# Altium project Rückleuchte.PrjPcb
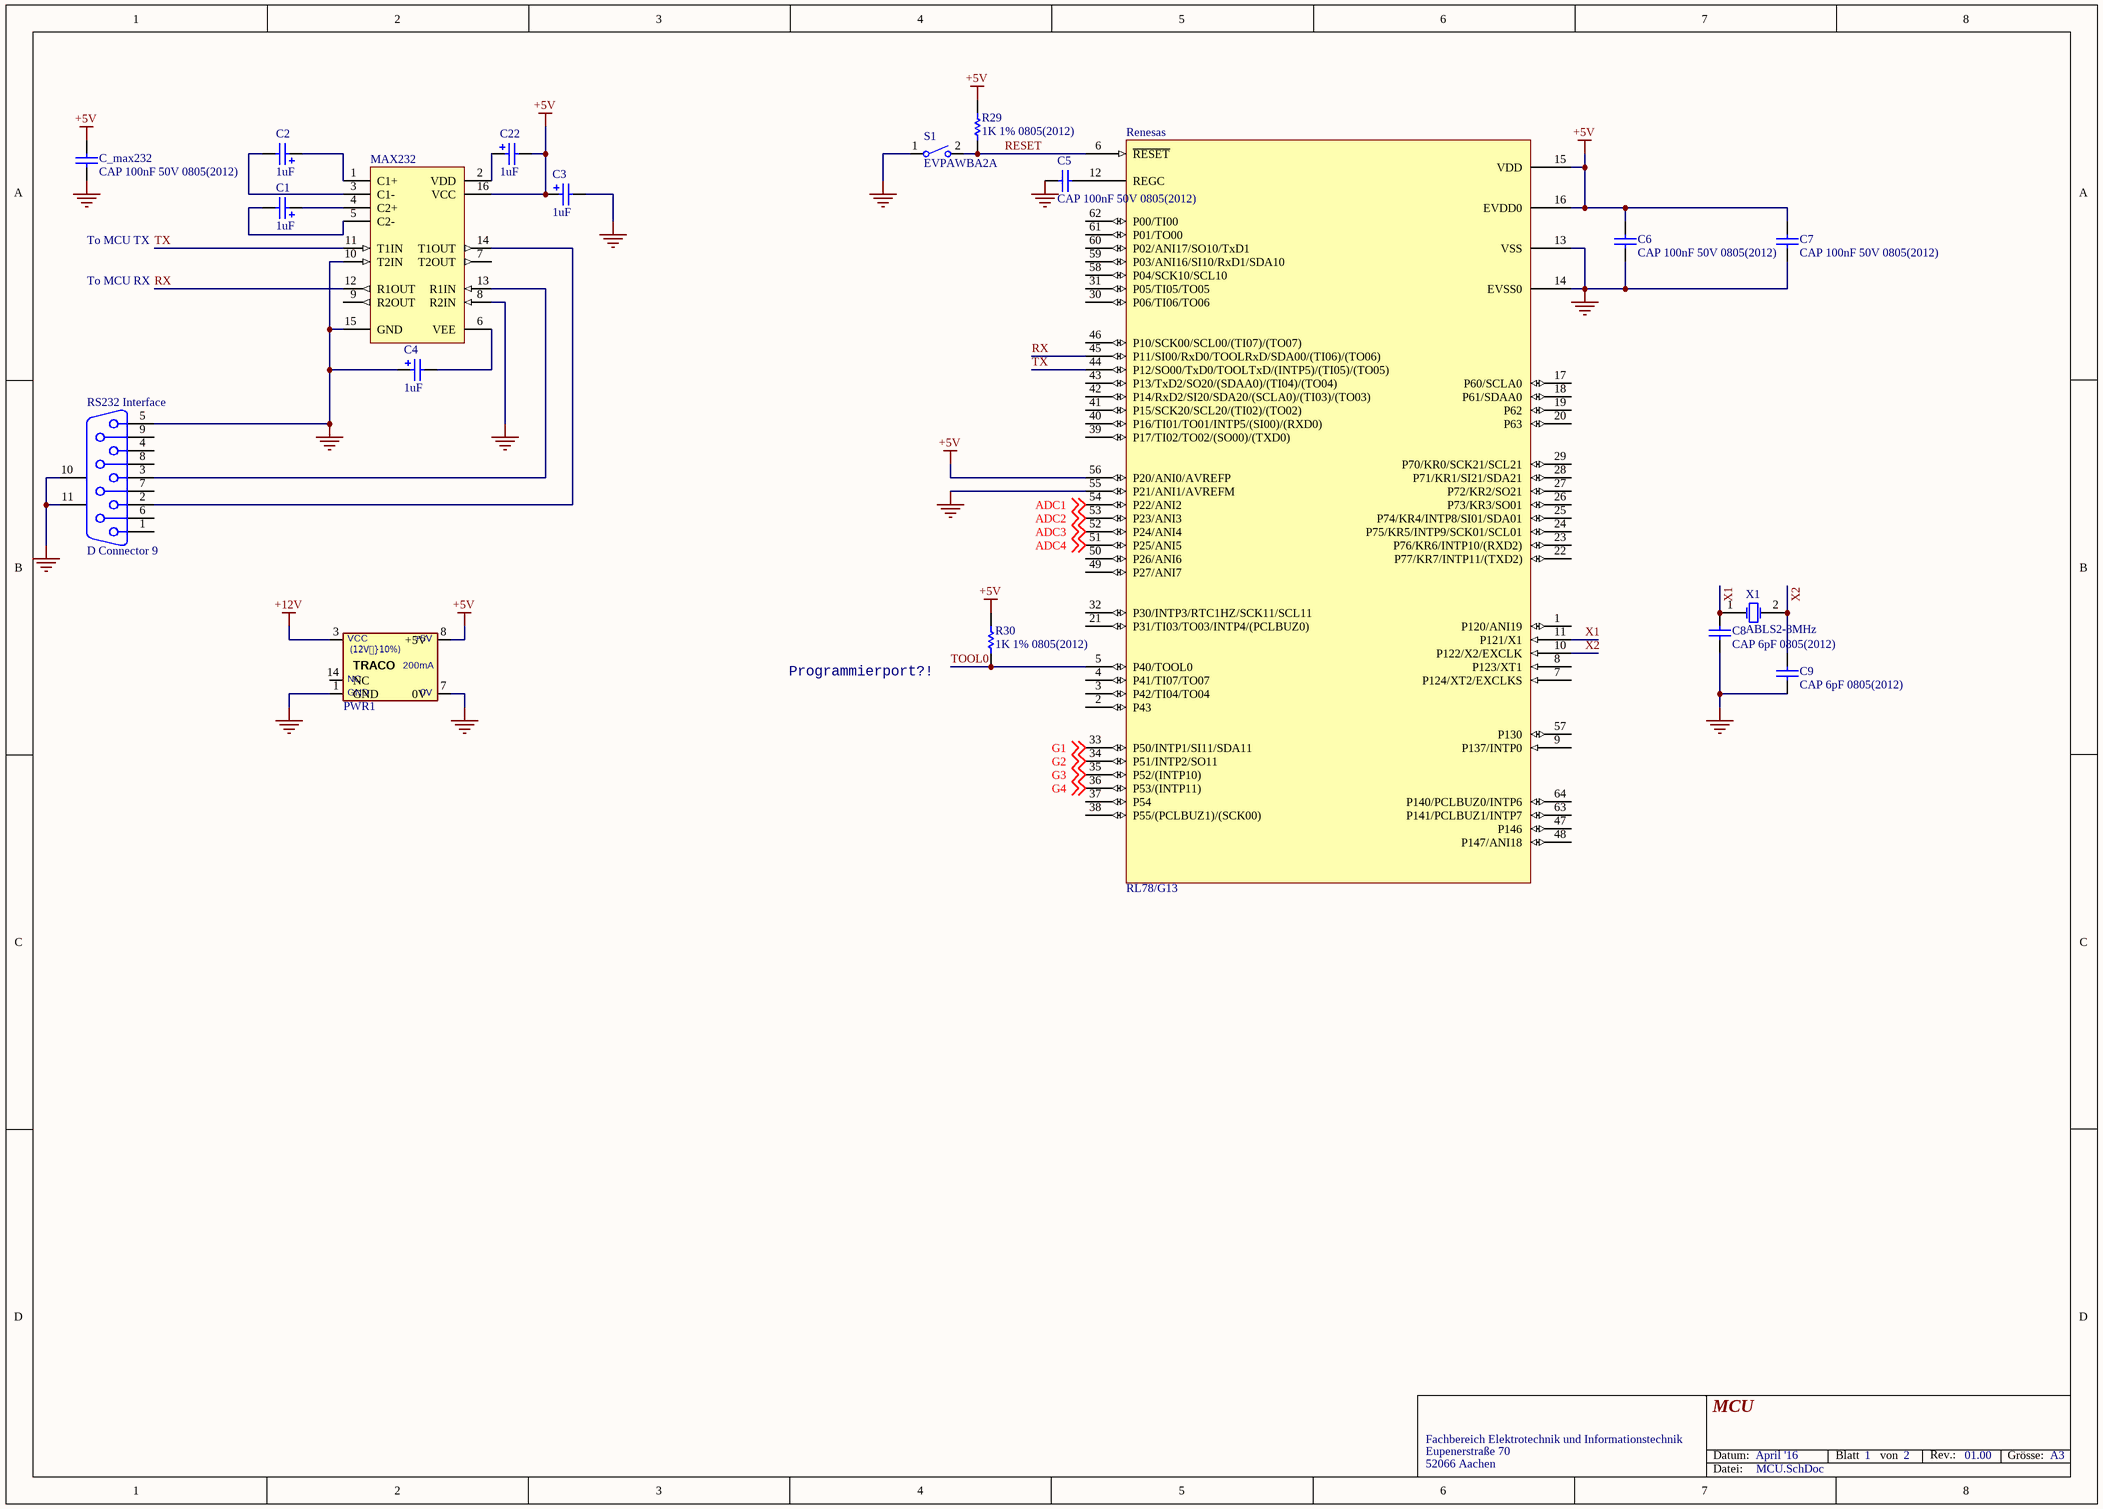
[diagram p0: MCU.SchDoc]
2 sheets, 59 parts. Net scope: global (net labels, ports and power ports of the same name join across sheets).
Sheets:
  MCU.SchDoc
  HS-Treiber.SchDoc

## Sheet MCU.SchDoc: MCU
size A3; Date: April '16; Organization: Fachhochschule Aachen; Address1: Fachbereich Elektrotechnik und Informationstechnik; Address2: Eupenerstraße 70; Address3: 52066 Aachen; DocumentNumber: 1; Revision: 01.00; SheetNumber: 1; SheetTotal: 2; ModifiedDate: -> Datum

### Parts
C1  value 1uF  [CC2012-0805]  (hidden comment: Cap Pol3)
C2  value 1uF  [CC2012-0805]  (hidden comment: Cap Pol3)
C3  value 1uF  [CC2012-0805]  (hidden comment: Cap Pol3)
C4  value 1uF  [CC2012-0805]  (hidden comment: Cap Pol3)
C5  CAP 100nF 50V 0805(2012)  [CAPC0805(2012)145_M]
C6  CAP 100nF 50V 0805(2012)  [CAPC0805(2012)145_M]
C7  CAP 100nF 50V 0805(2012)  [CAPC0805(2012)145_M]
C8  CAP 6pF 0805(2012)  [CAPC0805(2012)145_M]
C9  CAP 6pF 0805(2012)  [CAPC0805(2012)145_M]
C22  value 1uF  [CC2012-0805]  (hidden comment: Cap Pol3)
C_max232  CAP 100nF 50V 0805(2012)  [CAPC0805(2012)145_M]
MAX232  MAX232CSE  [NSO16]  (value not drawn)
PWR1  TES1-1211  [TES14]  (value not drawn)
R29  1K 1% 0805(2012)  [RESC0805(2012)_M]
R30  1K 1% 0805(2012)  [RESC0805(2012)_M]
Renesas  RL78/G13  [R5F100LEAFA - duplicate]
RS232_Interface  D Connector 9  [DSUB1.385-2H9]
S1  EVPAWBA2A  [PNSC-EVPAW_V]
X1  ABLS2-8MHz  [ABRA-ABLS2-2_V]

### Nets
+5V: C3.1 C6.2 C7.2 C22.2 C_max232.2 MAX232.16(VCC) PWR1.8(+5V) R29.1 R30.1 Renesas.15(VDD) Renesas.16(EVDD0) Renesas.56(P20/ANI0/AVREFP)
+12V: PWR1.3(VCC)
GND: C3.2 C4.1 C5.2 C6.1 C7.1 C8.1 C9.1 C_max232.1 MAX232.8(R2IN) MAX232.10(T2IN) MAX232.15(GND) PWR1.1(GND) PWR1.7(0V) Renesas.13(VSS) Renesas.14(EVSS0) Renesas.55(P21/ANI1/AVREFM) RS232_Interface.5 RS232_Interface.10(MH1) RS232_Interface.11(MH2) S1.1(A1)
ADC1: Renesas.54(P22/ANI2) ; off-sheet ADC1
ADC2: Renesas.53(P23/ANI3) ; off-sheet ADC2
ADC3: Renesas.52(P24/ANI4) ; off-sheet ADC3
ADC4: Renesas.51(P25/ANI5) ; off-sheet ADC4
G1: Renesas.33(P50/INTP1/SI11/SDA11) ; off-sheet G1
G2: Renesas.34(P51/INTP2/SO11) ; off-sheet G2
G3: Renesas.35(P52/(INTP10)) ; off-sheet G3
G4: Renesas.36(P53/(INTP11)) ; off-sheet G4
RESET: R29.2 Renesas.6(~{RESET}) S1.2(B1)
RX: MAX232.12(R1OUT) Renesas.45(P11/SI00/RxD0/TOOLRxD/SDA00/(TI06)/(TO06))
TOOL0: R30.2 Renesas.5(P40/TOOL0)
TX: MAX232.11(T1IN) Renesas.44(P12/SO00/TxD0/TOOLTxD/(INTP5)/(TI05)/(TO05))
X1: C8.2 Renesas.11(P121/X1) X1.1(X1)
X2: C9.2 Renesas.10(P122/X2/EXCLK) X1.2(X2)
NetC1_1: C1.1 MAX232.4(C2+)
NetC1_2: C1.2 MAX232.5(C2-)
NetC2_1: C2.1 MAX232.1(C1+)
NetC2_2: C2.2 MAX232.3(C1-)
NetC4_2: C4.2 MAX232.6(VEE)
NetC5_1: C5.1 Renesas.12(REGC)
NetC22_1: C22.1 MAX232.2(VDD)
NetMAX232_13: MAX232.13(R1IN) RS232_Interface.3
NetMAX232_14: MAX232.14(T1OUT) RS232_Interface.2

Not connected (* = marked no-connect by the designer): MAX232 7(T2OUT) 9(R2OUT); PWR1 14(NC); Renesas 1(P120/ANI19) 2(P43) 3(P42/TI04/TO04) 4(P41/TI07/TO07) 7(P124/XT2/EXCLKS) 8(P123/XT1) 9(P137/INTP0) 17(P60/SCLA0) 18(P61/SDAA0) 19(P62) 20(P63) 21(P31/TI03/TO03/INTP4/(PCLBUZ0)) 22(P77/KR7/INTP11/(TXD2)) 23(P76/KR6/INTP10/(RXD2)) 24(P75/KR5/INTP9/SCK01/SCL01) 25(P74/KR4/INTP8/SI01/SDA01) 26(P73/KR3/SO01) 27(P72/KR2/SO21) 28(P71/KR1/SI21/SDA21) 29(P70/KR0/SCK21/SCL21) 30(P06/TI06/TO06) 31(P05/TI05/TO05) 32(P30/INTP3/RTC1HZ/SCK11/SCL11) 37(P54) 38(P55/(PCLBUZ1)/(SCK00)) 39(P17/TI02/TO02/(SO00)/(TXD0)) 40(P16/TI01/TO01/INTP5/(SI00)/(RXD0)) 41(P15/SCK20/SCL20/(TI02)/(TO02)) 42(P14/RxD2/SI20/SDA20/(SCLA0)/(TI03)/(TO03)) 43(P13/TxD2/SO20/(SDAA0)/(TI04)/(TO04)) 46(P10/SCK00/SCL00/(TI07)/(TO07)) 47(P146) 48(P147/ANI18) 49(P27/ANI7) 50(P26/ANI6) 57(P130) 58(P04/SCK10/SCL10) 59(P03/ANI16/SI10/RxD1/SDA10) 60(P02/ANI17/SO10/TxD1) 61(P01/TO00) 62(P00/TI00) 63(P141/PCLBUZ1/INTP7) 64(P140/PCLBUZ0/INTP6); RS232_Interface 1 4 6 7 8 9

### Notes on the sheet
- To MCU TX
- To MCU RX
- Programmierport?!
- Datum:
- Blatt
- von
- Rev.:
- Grösse:
- A3
- Datei:
- (in symbol TES1-1211) (12V}10%); 200mA

### Library data of the parts
C1-C4 C22 = Cap Pol3: Polarized Capacitor (Surface Mount); Published: 8-Jun-2000; Revision: July-2002: Re-released for DXP Platform.; Publisher: Altium Limited
C5-C9 C_max232 = CMP-1036-04419-1: CAP 100nF 50V ±10% 0805 (2012 Metric) Thickness 1.45mm SMD; Tolerance: Â±10%; Case-EIA: 0805; Case-Metric: 2012; Rated Voltage: 50 V; Technology: SMT; Max Thickness: 1.45 mm; Value: 100nF
MAX232 = MAX232CSE: +5V Powered, Multi-Channel RS-232 Driver/Receiver; Code - JEDEC: MS-012-AC; Code - IPC: SO16; Published: 16-Jan-2001; Revision: 17-Jul-2002: Re-released for DXP Platform.; Package Reference: NSO16; Publisher: Altium Limited
PWR1 = TES1-1211: Input=12V}10% Output=5V 200mA 1W 1500VDC Isolation SMD14 RoHS; Manufactuer: TRACO; Manufactuer P/N: TES1-1211; HelpURL: http://www.tracopower.com/
R29 R30 = CMP-1013-00623-1: 10K 0.125W 1% 0805 (2012 Metric)  SMD; Value: 10000.00 Ohm; Case-Metric: 2012; Case-EIA: 0805; Tolerance: 1 %; Power: 0.125 W; Technology: SMT
RS232_Interface = D Connector 9: Receptacle Assembly, 9 Position, Right Angle; Package Information: Latest Revision: O; Positions: 9; Published: 15-Jun-2001; Revision: 17-Jul-2002: Re-released for DXP Platform.; Datasheet: (1-Sep-1999); Package Reference: 788750; Publisher: Altium Limited; Orientation: Right Angle; Gender: Receptacle
S1 = CMP-1339-00001-1: Light Touch Switch, 0.02 A at 15 VDC, 500 mOhm, -40 to 85 degC, 2-Pin 3 x 2 x 0.6 mm SMD, RoHS, Tape and Reel; Manufacturer: Panasonic; Contact Rating@2 VDC: 10 uA; Contact Resistance: 500 mOhm Max.; Contact Rating@15 VDC: 0.02 A; Insulation Resistance@100 VDC: 50 MOhm Min.; Bouncing: 10 ms Max.; RoHS: TRUE; Temperature Range: -40 to 85 degC; ComponentLink1URL: http://na.industrial.panasonic.com/; ComponentLink2URL: http://industrial.panasonic.com/www-data/pdf/ATK0000/ATK0000CE40.pdf; ComponentLink2Description: Datasheet; ComponentLink1Description: Manufacturer URL; ComponentLink3URL: http://industrial.panasonic.com/www-data/pdf/ATK0000/ATK0000CE40.pdf; PackageDescription: 2-Pin Surface Mount Device, Body 3 x 2 mm, Pitch 3.25 mm; DatasheetVersion: May-14; Mounting Technology: Surface Mount; Packing: Tape and Reel; PartNumber: EVPAWBA2A; ComponentLink3Description: Package Specification
X1 = CMP-0277-00002-1: Low Profile Surface Mount Microprocessor Crystal, 4.096 MHz +/-30 ppm, 180 Ohm, -40 to 85 degC, 2-Pin 11.4 x 4.7 x 3.3 mm SMD, RoHS, Tape and Reel; Manufacturer: Abracon; PartNumber: ABLS2-4.096MHZ-D4Y-T; Operation Mode: Fundamental or 3rd Overtone; Shunt Capacitance: 7 pF Max.; ESR: 180 Ohm; Load Capacitance: 18 pF; Mounting Technology: Surface Mount; PackageDescription: 2-Pin SMD, Body 11.4 x 4.7 mm, Height 3.3 mm; ComponentLink1URL: http://www.abracon.com/; Freq. Stability: +/- 30 ppm; ComponentLink2Description: Datasheet; Operating Temp. Range: -40 to 85 degC; Packing: Tape and Reel; RoHS: TRUE; PackageReference: ABLS2-2; DatasheetVersion: Rev. 03.31.11; Freq. Tolerance: +/- 30 ppm; Frequency: 4.096 MHz; ComponentLink2URL: http://www.abracon.com/Resonators/ABLS2.pdf; ComponentLink1Description: Manufacturer URL

## Sheet HS-Treiber.SchDoc: HS-Treiber/Messung
size A4; Date: April '16; DrawnBy: Student; DocumentNumber: 2; SheetNumber: 2; SheetTotal: 2
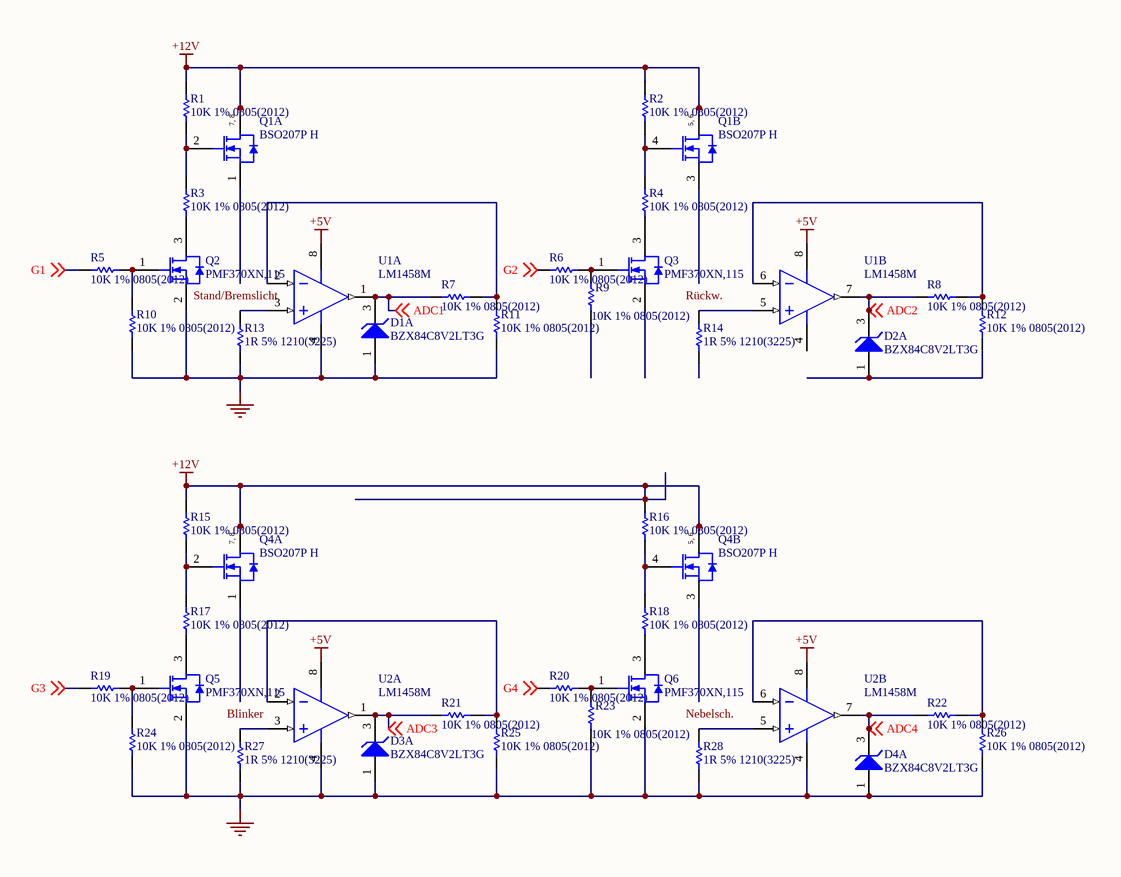
[diagram p1: HS-Treiber.SchDoc]

### Parts
D1  BZX84C8V2LT3G  [ONSC-SOT-23-3-318-08_V]  (part A of 2)
D2  BZX84C8V2LT3G  [ONSC-SOT-23-3-318-08_V]  (part A of 2)
D3  BZX84C8V2LT3G  [ONSC-SOT-23-3-318-08_V]  (part A of 2)
D4  BZX84C8V2LT3G  [ONSC-SOT-23-3-318-08_V]  (part A of 2)
Q1  BSO207P H  [INF-PG-DSO-8-3_L]  (parts A,B of 2)
Q2  PMF370XN,115  [NXP-SOT323_M]
Q3  PMF370XN,115  [NXP-SOT323_M]
Q4  BSO207P H  [INF-PG-DSO-8-3_L]  (parts A,B of 2)
Q5  PMF370XN,115  [NXP-SOT323_M]
Q6  PMF370XN,115  [NXP-SOT323_M]
R1  10K 1% 0805(2012)  [RESC0805(2012)_M]
R2  10K 1% 0805(2012)  [RESC0805(2012)_M]
R3  10K 1% 0805(2012)  [RESC0805(2012)_M]
R4  10K 1% 0805(2012)  [RESC0805(2012)_M]
R5  10K 1% 0805(2012)  [RESC0805(2012)_M]
R6  10K 1% 0805(2012)  [RESC0805(2012)_M]
R7  10K 1% 0805(2012)  [RESC0805(2012)_M]
R8  10K 1% 0805(2012)  [RESC0805(2012)_M]
R9  10K 1% 0805(2012)  [RESC0805(2012)_M]
R10  10K 1% 0805(2012)  [RESC0805(2012)_M]
R11  10K 1% 0805(2012)  [RESC0805(2012)_M]
R12  10K 1% 0805(2012)  [RESC0805(2012)_M]
R13  1R 5% 1210(3225)  [RESC1210(3225)_N]
R14  1R 5% 1210(3225)  [RESC1210(3225)_N]
R15  10K 1% 0805(2012)  [RESC0805(2012)_M]
R16  10K 1% 0805(2012)  [RESC0805(2012)_M]
R17  10K 1% 0805(2012)  [RESC0805(2012)_M]
R18  10K 1% 0805(2012)  [RESC0805(2012)_M]
R19  10K 1% 0805(2012)  [RESC0805(2012)_M]
R20  10K 1% 0805(2012)  [RESC0805(2012)_M]
R21  10K 1% 0805(2012)  [RESC0805(2012)_M]
R22  10K 1% 0805(2012)  [RESC0805(2012)_M]
R23  10K 1% 0805(2012)  [RESC0805(2012)_M]
R24  10K 1% 0805(2012)  [RESC0805(2012)_M]
R25  10K 1% 0805(2012)  [RESC0805(2012)_M]
R26  10K 1% 0805(2012)  [RESC0805(2012)_M]
R27  1R 5% 1210(3225)  [RESC1210(3225)_N]
R28  1R 5% 1210(3225)  [RESC1210(3225)_N]
U1  LM1458M  [M08A_L]  (parts A,B of 2)
U2  LM1458M  [M08A_L]  (parts A,B of 2)

### Nets
+5V: U1.8(V+) U2.8(V+)
+12V: Q1.5(D2) Q1.6(D2) Q1.7(D1) Q1.8(D1) Q4.5(D2) Q4.6(D2) Q4.7(D1) Q4.8(D1) R1.1 R2.1 R15.1 R16.1
GND: D1.1(A) D3.1(A) D4.1(A) Q2.2(S) Q5.2(S) Q6.2(S) R10.2 R11.2 R13.2 R23.2 R24.2 R25.2 R26.2 R27.2 R28.2 U1.4(V-) U2.4(V-)
ADC1: D1.3(K) R7.1 U1.1(OUTA) ; off-sheet ADC1
ADC2: D2.3(K) R8.2 U1.7(OUTB) ; off-sheet ADC2
ADC3: D3.3(K) R21.1 U2.1(OUTA) ; off-sheet ADC3
ADC4: D4.3(K) R22.2 U2.7(OUTB) ; off-sheet ADC4
G1: R5.2 ; off-sheet G1
G2: R6.2 ; off-sheet G2
G3: R19.2 ; off-sheet G3
G4: R20.2 ; off-sheet G4
NetD2_1: D2.1(A) R12.2
NetQ1_2: Q1.2(G1) R1.2 R3.1
NetQ1_4: Q1.4(G2) R2.2 R4.1
NetQ2_1: Q2.1(G) R5.1 R10.1
NetQ2_3: Q2.3(D) R3.2
NetQ3_1: Q3.1(G) R6.1 R9.1
NetQ3_3: Q3.3(D) R4.2
NetQ4_2: Q4.2(G1) R15.2 R17.1
NetQ4_4: Q4.4(G2) R16.2 R18.1
NetQ5_1: Q5.1(G) R19.1 R24.1
NetQ5_3: Q5.3(D) R17.2
NetQ6_1: Q6.1(G) R20.1 R23.1
NetQ6_3: Q6.3(D) R18.2
NetR7_2: R7.2 R11.1 U1.2(INA-)
NetR8_1: R8.1 R12.1 U1.6(INB-)
NetR13_1: R13.1 U1.3(INA+)
NetR14_1: R14.1 U1.5(INB+)
NetR21_2: R21.2 R25.1 U2.2(INA-)
NetR22_1: R22.1 R26.1 U2.6(INB-)
NetR27_1: R27.1 U2.3(INA+)
NetR28_1: R28.1 U2.5(INB+)

Not connected (* = marked no-connect by the designer): Q1 1(S1) 3(S2); Q3 2(S); Q4 1(S1) 3(S2); R9 2; R14 2

### Notes on the sheet
- Stand/Bremslicht
- (near R14) Rückw.
- Blinker
- (near R28) Nebelsch.
- Datum:
- Blatt
- von
- Rev.:
- Grösse:
- A4
- Datei:
- (in symbol CMP-1099-00011-1, part A) 7, 8
- (in symbol CMP-1099-00011-1, part B) 5, 6

### Library data of the parts
D1-D4 = CMP-1060-01015-1: Zener Voltage Regulator, 225 mW, 3-Pin SOT-23, Pb-Free, Tape and Reel; Manufacturer: On Semiconductor; ComponentLink1Description: Manufacturer URL; PackageReference: SOT-23-3-318-08; ComponentLink3URL: http://www.onsemi.cn/pub_link/Collateral/318-08.PDF; Mounting Technology: Surface Mount; PackageDescription: 3-Pin Small Outline Transistor, Body 2.92 x 1.3 mm, Pitch 0.95 mm; PartNumber: BZX84C8V2LT3G; DatasheetVersion: Rev. 17; RoHS: Pb-Free; ComponentLink3Description: Package Specification; ComponentLink2Description: Datasheet; ComponentLink1URL: http://www.onsemi.com/; Packing: Tape and Reel; ComponentLink2URL: http://www.onsemi.com/pub_link/Collateral/BZX84C2V4LT1-D.PDF; PackageVersion: Rev. AP, 11/2009; PartId: 1
Q1 Q4 = CMP-1099-00011-1: P-Channel OptiMOS P Power-Transistor, -20 V VDS, -5.7 A ID, -55 to 150 degC, PG-DSO-8-3, Reel, Green; Manufacturer: Infineon; VGS(th) (max): -1.2Â V; IDpuls (max): -22.8Â A; Pto t (max): 1.6Â W; Rth: 110Â K/W; RDS (on) (max) (@4.5V): 45Â mOhm; RDS (on) (max) (@2.5V): 70Â mOhm; QG: -12Â nC; ID (max): -5.7Â A; Green: TRUE; VDS (max): -20Â V; VGS(th) (min): -0.6Â V; Mounting Technology: Surface Mount; PartNumber: BSO207P H; PackageReference: PG-DSO-8-3; ComponentLink1URL: http://www.infineon.com/; ComponentLink2URL: http://www.infineon.com/dgdl/BSO207P_H_1+3.pdf?folderId=db3a304314dca38901154a7313d21a66&fileId=db3a304326c2768b0126d138507b685e; Packing: Reel; ComponentLink1Description: Manufacturer URL; ComponentLink3Description: Package Specification; Halogen-free: TRUE; ComponentLink2Description: Datasheet; DatasheetVersion: Rev. 1.3; PackageDescription: 8-Pin Plastic (Green) Dual Small Outline Package, 4.9 x 3.9 mm Body, 1.27 mm Pitch; RDS (on) (max): 70Â mOhm; ComponentLink3URL: http://www.infineon.com/cms/packages/SMD_-_Surface_Mounted_Devices/P-PG-DSO/P-PG-DSO-08-03x_-6x_-7x_-8x_-10x_-13x_-15x_-18x_-19x_-20x_-23.html?__locale=en; PartId: 1
Q2 Q3 Q5 Q6 = CMP-1258-00167-1: N-Channel TrenchMOS Extremely Low Level FET, 30 V, 0.87 A, 3-Pin SOT323, Tape and Reel; Manufacturer: NXP Semiconductors; VDS [max] (V): 30; VGSth [typ] (V): 1; Packing: Tape & Reel; Channel Type: N; Ciss [typ] (pF): 37; ID [max] (A): 0.87; Coss [typ] (pF): 8.5; Code_JEITA: SC-70; ComponentLink3URL: http://www.nxp.com/documents/outline_drawing/sot323_po.pdf; ComponentLink1URL: http://www.nxp.com/; Mounting Technology: Surface Mount; ComponentLink2URL: http://www.nxp.com/documents/data_sheet/PMF370XN.pdf; DatasheetVersion: Rev. 03; PackageReference: SOT323; ComponentLink1Description: Manufacturer URL; ComponentLink2Description: Datasheet; PackageDescription: 3-Pin Small Outline Transistor Package, Body 2 x 1.25 mm, Pitch 0.65 mm; PartNumber: PMF370XN,115; ComponentLink3Description: Package Specification; PackageVersion: 06-03-16, 03/2006
R1-R12 R15-R26 = CMP-1013-00623-1: as R29 on sheet MCU; Tolerance: 1 %; Power: 0.125 W; Technology: SMT
R13 R14 R27 R28 = CMP-1015-00002-1: 1R 0.5W 5% 1210 (3225 Metric)  SMD; Case-EIA: 1210; Value: 1.00 Ohm; Case-Metric: 3225; Power: 0.5 W; Technology: SMT; Tolerance: 5 %
U1 U2 = CMP-0055-00685-2: Dual Operational Amplifier, 8-pin Narrow SOIC; Manufacturer: National Semiconductor; CompType: Amplifiers; PackageTopMarking: NSZXTT*LM*1458M; PowerWise: N; PackageDescription: SOIC Narrow, 4.9 x 3.9 x 1.45mm, 8 Lead, 1.27mm Pitch; ComponentLink1Description: LM1458 Datasheet; RoHS: N; Code_IPC: SOIC127P600-8; ComponentLink2Description: LM1458 Web Page; ComponentLink1URL: http://www.national.com/ds/LM/LM1458.pdf; PackageVersion: revM, May-2009; RevisionNote: Component URLs added; PinCount: 8; Code_JEDEC: MS-012-AA; ComponentLink3URL: http://www.national.com/packaging/folders/m08a.html; DatasheetVersion: Aug-2003; ComponentLink2URL: http://www.national.com/pf/LM/LM1458.html; PackageReference: M08A; ComponentLink3Description: M08A Package Page; PartId: 1

## Nets that join several sheets
+5V: MCU (12 pins), HS-Treiber (U1.8 U2.8)
+12V: MCU (PWR1.3), HS-Treiber (12 pins)
GND: MCU (20 pins), HS-Treiber (17 pins)
ADC1: MCU (Renesas.54), HS-Treiber (D1.3 R7.1 U1.1)
ADC2: MCU (Renesas.53), HS-Treiber (D2.3 R8.2 U1.7)
ADC3: MCU (Renesas.52), HS-Treiber (D3.3 R21.1 U2.1)
ADC4: MCU (Renesas.51), HS-Treiber (D4.3 R22.2 U2.7)
G1: MCU (Renesas.33), HS-Treiber (R5.2)
G2: MCU (Renesas.34), HS-Treiber (R6.2)
G3: MCU (Renesas.35), HS-Treiber (R19.2)
G4: MCU (Renesas.36), HS-Treiber (R20.2)